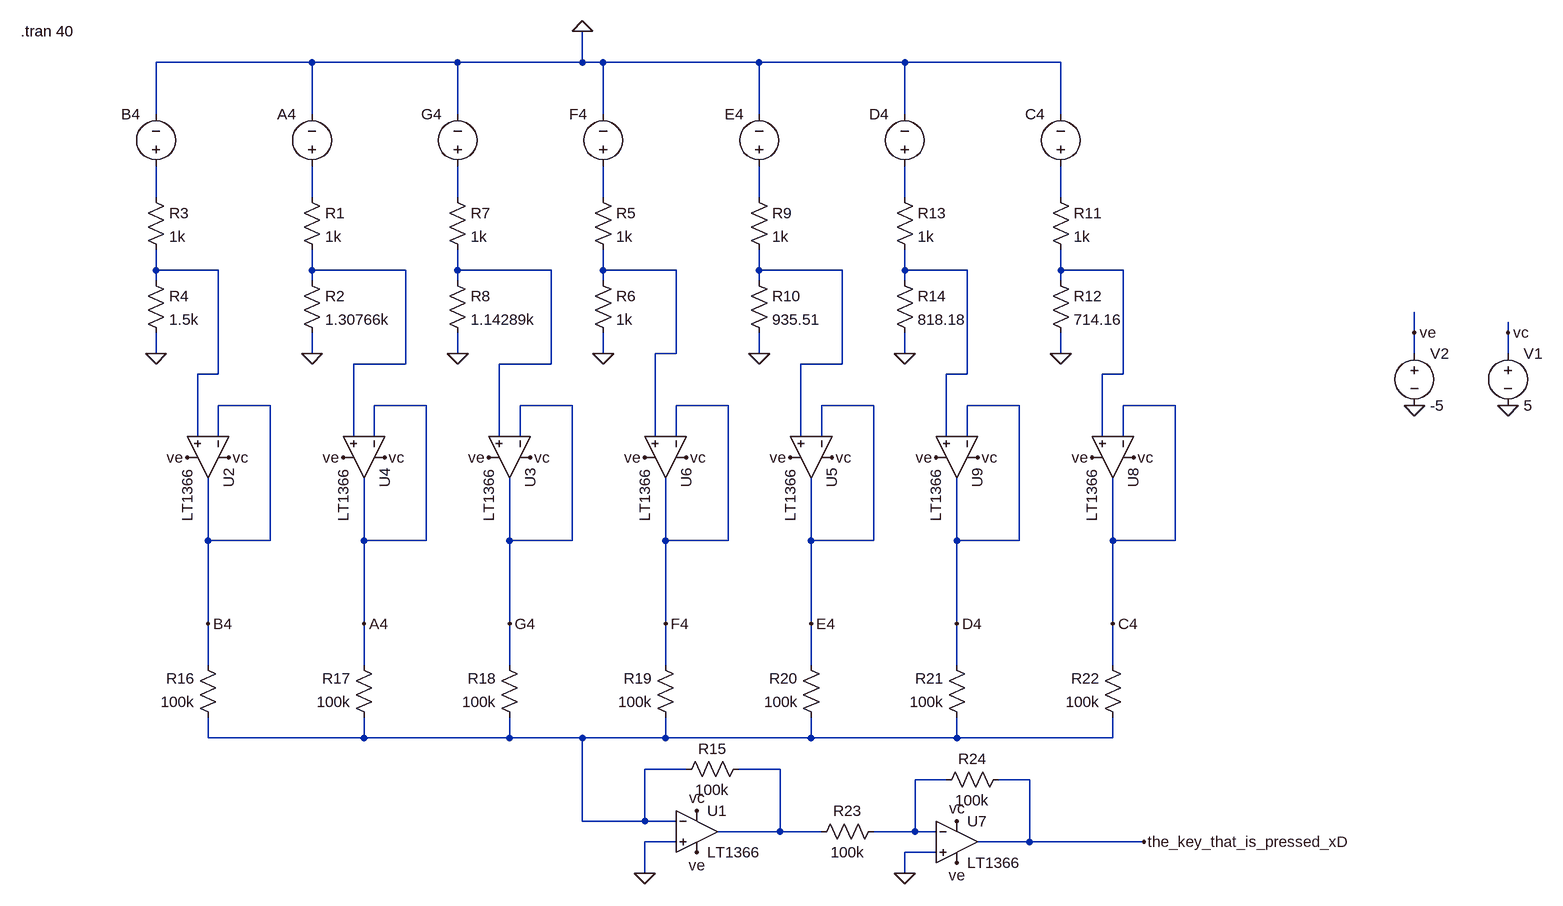
[diagram p0: schematic keyboard_controls_unfinished.asc]
keyboard_controls_unfinished.asc, the LTspice schematic file:
Version 4
SHEET 1 1096 1716
WIRE -800 48 -1040 48
WIRE -576 48 -800 48
WIRE -384 48 -384 0
WIRE -384 48 -576 48
WIRE -352 48 -384 48
WIRE -112 48 -352 48
WIRE 112 48 -112 48
WIRE 352 48 112 48
WIRE -1040 128 -1040 48
WIRE -800 128 -800 48
WIRE -576 128 -576 48
WIRE -352 128 -352 48
WIRE -112 128 -112 48
WIRE 112 128 112 48
WIRE 352 128 352 48
WIRE -1040 256 -1040 208
WIRE -800 256 -800 208
WIRE -576 256 -576 208
WIRE -352 256 -352 208
WIRE -112 256 -112 208
WIRE 112 256 112 208
WIRE 352 256 352 208
WIRE -1040 368 -1040 336
WIRE -944 368 -1040 368
WIRE -800 368 -800 336
WIRE -656 368 -800 368
WIRE -576 368 -576 336
WIRE -432 368 -576 368
WIRE -352 368 -352 336
WIRE -240 368 -352 368
WIRE -112 368 -112 336
WIRE 16 368 -112 368
WIRE 112 368 112 336
WIRE 208 368 112 368
WIRE 352 368 352 336
WIRE 448 368 352 368
WIRE -1040 384 -1040 368
WIRE -800 384 -800 368
WIRE -576 384 -576 368
WIRE -352 384 -352 368
WIRE -112 384 -112 368
WIRE 112 384 112 368
WIRE 352 384 352 368
WIRE 896 464 896 432
WIRE 1040 464 1040 448
WIRE -1040 496 -1040 464
WIRE -800 496 -800 464
WIRE -576 496 -576 464
WIRE -352 496 -352 464
WIRE -240 496 -240 368
WIRE -240 496 -272 496
WIRE -112 496 -112 464
WIRE 112 496 112 464
WIRE 352 496 352 464
WIRE 896 496 896 464
WIRE 1040 496 1040 464
WIRE -656 512 -656 368
WIRE -656 512 -736 512
WIRE -432 512 -432 368
WIRE -432 512 -512 512
WIRE 16 512 16 368
WIRE 16 512 -48 512
WIRE -944 528 -944 368
WIRE -944 528 -976 528
WIRE 208 528 208 368
WIRE 208 528 176 528
WIRE 448 528 448 368
WIRE 448 528 416 528
WIRE -864 576 -944 576
WIRE -624 576 -704 576
WIRE -400 576 -480 576
WIRE -160 576 -240 576
WIRE 64 576 -16 576
WIRE 288 576 208 576
WIRE 528 576 448 576
WIRE -976 624 -976 528
WIRE -944 624 -944 576
WIRE -736 624 -736 512
WIRE -704 624 -704 576
WIRE -512 624 -512 512
WIRE -480 624 -480 576
WIRE -272 624 -272 496
WIRE -240 624 -240 576
WIRE -48 624 -48 512
WIRE -16 624 -16 576
WIRE 176 624 176 528
WIRE 208 624 208 576
WIRE 416 624 416 528
WIRE 448 624 448 576
WIRE -960 784 -960 688
WIRE -864 784 -864 576
WIRE -864 784 -960 784
WIRE -720 784 -720 688
WIRE -624 784 -624 576
WIRE -624 784 -720 784
WIRE -496 784 -496 688
WIRE -400 784 -400 576
WIRE -400 784 -496 784
WIRE -256 784 -256 688
WIRE -160 784 -160 576
WIRE -160 784 -256 784
WIRE -32 784 -32 688
WIRE 64 784 64 576
WIRE 64 784 -32 784
WIRE 192 784 192 688
WIRE 288 784 288 576
WIRE 288 784 192 784
WIRE 432 784 432 688
WIRE 528 784 528 576
WIRE 528 784 432 784
WIRE -960 912 -960 784
WIRE -720 912 -720 784
WIRE -496 912 -496 784
WIRE -256 912 -256 784
WIRE -32 912 -32 784
WIRE 192 912 192 784
WIRE 432 912 432 784
WIRE -960 976 -960 912
WIRE -720 976 -720 912
WIRE -496 976 -496 912
WIRE -256 976 -256 912
WIRE -32 976 -32 912
WIRE 192 976 192 912
WIRE 432 976 432 912
WIRE -960 1088 -960 1056
WIRE -720 1088 -720 1056
WIRE -720 1088 -960 1088
WIRE -496 1088 -496 1056
WIRE -496 1088 -720 1088
WIRE -384 1088 -496 1088
WIRE -256 1088 -256 1056
WIRE -256 1088 -384 1088
WIRE -32 1088 -32 1056
WIRE -32 1088 -256 1088
WIRE 192 1088 192 1056
WIRE 192 1088 -32 1088
WIRE 432 1088 432 1056
WIRE 432 1088 192 1088
WIRE -224 1136 -288 1136
WIRE -80 1136 -144 1136
WIRE 176 1152 128 1152
WIRE 304 1152 256 1152
WIRE -384 1216 -384 1088
WIRE -288 1216 -288 1136
WIRE -288 1216 -384 1216
WIRE -240 1216 -288 1216
WIRE -80 1232 -80 1136
WIRE -80 1232 -176 1232
WIRE -16 1232 -80 1232
WIRE 128 1232 128 1152
WIRE 128 1232 64 1232
WIRE 160 1232 128 1232
WIRE -240 1248 -288 1248
WIRE 304 1248 304 1152
WIRE 304 1248 224 1248
WIRE 480 1248 304 1248
WIRE 160 1264 112 1264
WIRE -288 1296 -288 1248
WIRE 112 1296 112 1264
FLAG -800 496 0
FLAG -1040 496 0
FLAG -352 496 0
FLAG -576 496 0
FLAG -112 496 0
FLAG 352 496 0
FLAG 112 496 0
FLAG -384 0 0
FLAG 432 912 C4
FLAG 192 912 D4
FLAG -32 912 E4
FLAG -256 912 F4
FLAG -496 912 G4
FLAG -720 912 A4
FLAG -960 912 B4
FLAG -288 1296 0
FLAG 1040 576 0
FLAG 1040 464 vc
FLAG 896 576 0
FLAG 896 464 ve
FLAG 464 656 vc
FLAG 224 656 vc
FLAG 0 656 vc
FLAG -224 656 vc
FLAG -464 656 vc
FLAG -688 656 vc
FLAG -928 656 vc
FLAG -208 1200 vc
FLAG 400 656 ve
FLAG 160 656 ve
FLAG -64 656 ve
FLAG -288 656 ve
FLAG -528 656 ve
FLAG -752 656 ve
FLAG -992 656 ve
FLAG -208 1264 ve
FLAG 112 1296 0
FLAG 192 1216 vc
FLAG 192 1280 ve
FLAG 480 1248 the_key_that_is_pressed_xD
SYMBOL res -816 240 R0
SYMATTR InstName R1
SYMATTR Value 1k
SYMBOL res -816 368 R0
SYMATTR InstName R2
SYMATTR Value 1.30766k
SYMBOL res -1056 240 R0
SYMATTR InstName R3
SYMATTR Value 1k
SYMBOL res -1056 368 R0
SYMATTR InstName R4
SYMATTR Value 1.5k
SYMBOL res -368 240 R0
SYMATTR InstName R5
SYMATTR Value 1k
SYMBOL res -368 368 R0
SYMATTR InstName R6
SYMATTR Value 1k
SYMBOL res -592 240 R0
SYMATTR InstName R7
SYMATTR Value 1k
SYMBOL res -592 368 R0
SYMATTR InstName R8
SYMATTR Value 1.14289k
SYMBOL res -128 240 R0
SYMATTR InstName R9
SYMATTR Value 1k
SYMBOL res -128 368 R0
SYMATTR InstName R10
SYMATTR Value 935.51
SYMBOL res 336 240 R0
SYMATTR InstName R11
SYMATTR Value 1k
SYMBOL res 336 368 R0
SYMATTR InstName R12
SYMATTR Value 714.16
SYMBOL res 96 240 R0
SYMATTR InstName R13
SYMATTR Value 1k
SYMBOL res 96 368 R0
SYMATTR InstName R14
SYMATTR Value 818.18
SYMBOL voltage -1040 224 R180
WINDOW 0 24 96 Left 2
WINDOW 3 24 16 Invisible 2
WINDOW 123 0 0 Left 0
WINDOW 39 0 0 Left 0
SYMATTR InstName B4
SYMATTR Value PWL(30.499999 0 30.5 5 35 5 35.00000000001 0)
SYMBOL voltage -800 224 R180
WINDOW 0 24 96 Left 2
WINDOW 3 24 16 Invisible 2
WINDOW 123 0 0 Left 0
WINDOW 39 0 0 Left 0
SYMATTR InstName A4
SYMATTR Value PWL(25.49999999 0 25.5 5 30 5 30.00000000000001 0)
SYMBOL voltage -576 224 R180
WINDOW 0 24 96 Left 2
WINDOW 3 24 68 Invisible 2
WINDOW 123 0 0 Left 0
WINDOW 39 0 0 Left 0
SYMATTR InstName G4
SYMATTR Value PWL(20.4999999 0 20.5 5 25 5 25.0000000001 0)
SYMBOL voltage -352 224 R180
WINDOW 0 24 96 Left 2
WINDOW 3 24 68 Invisible 2
WINDOW 123 0 0 Left 0
WINDOW 39 0 0 Left 0
SYMATTR InstName F4
SYMATTR Value PWL(15.499999 0 15.5 5 20 5 20.00000001 0)
SYMBOL voltage -112 224 R180
WINDOW 0 24 96 Left 2
WINDOW 3 24 68 Invisible 2
WINDOW 123 0 0 Left 0
WINDOW 39 0 0 Left 0
SYMATTR InstName E4
SYMATTR Value PWL(10.499999 0 10.5 5 15 5 15.00000001 0)
SYMBOL voltage 112 224 R180
WINDOW 0 24 96 Left 2
WINDOW 3 24 68 Invisible 2
WINDOW 123 0 0 Left 0
WINDOW 39 0 0 Left 0
SYMATTR InstName D4
SYMATTR Value PWL(5.49999 0 5.5 5 10 5 10.000001 0)
SYMBOL voltage 352 224 R180
WINDOW 0 24 96 Left 2
WINDOW 3 24 68 Invisible 2
WINDOW 123 0 0 Left 0
WINDOW 39 0 0 Left 0
SYMATTR InstName C4
SYMATTR Value PWL(0 5 5 5 5.00000001 0)
SYMBOL Opamps\\LT1366 -208 1168 R0
SYMATTR InstName U1
SYMBOL res -128 1120 R90
WINDOW 0 0 56 VBottom 2
WINDOW 3 32 56 VTop 2
SYMATTR InstName R15
SYMATTR Value 100k
SYMBOL res -944 1072 R180
WINDOW 0 36 76 Left 2
WINDOW 3 36 40 Left 2
SYMATTR InstName R16
SYMATTR Value 100k
SYMBOL res -704 1072 R180
WINDOW 0 36 76 Left 2
WINDOW 3 36 40 Left 2
SYMATTR InstName R17
SYMATTR Value 100k
SYMBOL res -480 1072 R180
WINDOW 0 36 76 Left 2
WINDOW 3 36 40 Left 2
SYMATTR InstName R18
SYMATTR Value 100k
SYMBOL res -240 1072 R180
WINDOW 0 36 76 Left 2
WINDOW 3 36 40 Left 2
SYMATTR InstName R19
SYMATTR Value 100k
SYMBOL res -16 1072 R180
WINDOW 0 36 76 Left 2
WINDOW 3 36 40 Left 2
SYMATTR InstName R20
SYMATTR Value 100k
SYMBOL res 208 1072 R180
WINDOW 0 36 76 Left 2
WINDOW 3 36 40 Left 2
SYMATTR InstName R21
SYMATTR Value 100k
SYMBOL res 448 1072 R180
WINDOW 0 36 76 Left 2
WINDOW 3 36 40 Left 2
SYMATTR InstName R22
SYMATTR Value 100k
SYMBOL Opamps\\LT1366 -432 656 R90
SYMATTR InstName U3
SYMBOL Opamps\\LT1366 -896 656 R90
SYMATTR InstName U2
SYMBOL Opamps\\LT1366 -656 656 R90
SYMATTR InstName U4
SYMBOL Opamps\\LT1366 32 656 R90
SYMATTR InstName U5
SYMBOL Opamps\\LT1366 -192 656 R90
SYMATTR InstName U6
SYMBOL Opamps\\LT1366 496 656 R90
SYMATTR InstName U8
SYMBOL Opamps\\LT1366 256 656 R90
SYMATTR InstName U9
SYMBOL voltage 1040 480 R0
SYMATTR InstName V1
SYMATTR Value 5
SYMBOL voltage 896 480 R0
SYMATTR InstName V2
SYMATTR Value -5
SYMBOL Opamps\\LT1366 192 1184 R0
SYMATTR InstName U7
SYMBOL res 80 1216 R90
WINDOW 0 0 56 VBottom 2
WINDOW 3 32 56 VTop 2
SYMATTR InstName R23
SYMATTR Value 100k
SYMBOL res 272 1136 R90
WINDOW 0 0 56 VBottom 2
WINDOW 3 32 56 VTop 2
SYMATTR InstName R24
SYMATTR Value 100k
TEXT -1248 0 Left 2 !.tran 40

The netlist it stands for:
* keyboard_controls_unfinished.asc
R1 N002 N009 1k
R2 N009 0 1.30766k
R3 N001 N008 1k
R4 N008 0 1.5k
R5 N004 N011 1k
R6 N011 0 1k
R7 N003 N010 1k
R8 N010 0 1.14289k
R9 N005 N012 1k
R10 N012 0 935.51
R11 N007 N014 1k
R12 N014 0 714.16
R13 N006 N013 1k
R14 N013 0 818.18
V§B4 N001 0 PWL(30.499999 0 30.5 5 35 5 35.00000000001 0)
V§A4 N002 0 PWL(25.49999999 0 25.5 5 30 5 30.00000000000001 0)
V§G4 N003 0 PWL(20.4999999 0 20.5 5 25 5 25.0000000001 0)
V§F4 N004 0 PWL(15.499999 0 15.5 5 20 5 20.00000001 0)
V§E4 N005 0 PWL(10.499999 0 10.5 5 15 5 15.00000001 0)
V§D4 N006 0 PWL(5.49999 0 5.5 5 10 5 10.000001 0)
V§C4 N007 0 PWL(0 5 5 5 5.00000001 0)
XU1 0 N015 vc ve N016 LT1366  ; pins In+ In- V+ V- OUT
R15 N016 N015 100k
R16 N015 B4 100k
R17 N015 A4 100k
R18 N015 G4 100k
R19 N015 F4 100k
R20 N015 E4 100k
R21 N015 D4 100k
R22 N015 C4 100k
XU3 N010 G4 vc ve G4 LT1366  ; pins In+ In- V+ V- OUT
XU2 N008 B4 vc ve B4 LT1366  ; pins In+ In- V+ V- OUT
XU4 N009 A4 vc ve A4 LT1366  ; pins In+ In- V+ V- OUT
XU5 N012 E4 vc ve E4 LT1366  ; pins In+ In- V+ V- OUT
XU6 N011 F4 vc ve F4 LT1366  ; pins In+ In- V+ V- OUT
XU8 N014 C4 vc ve C4 LT1366  ; pins In+ In- V+ V- OUT
XU9 N013 D4 vc ve D4 LT1366  ; pins In+ In- V+ V- OUT
V1 vc 0 5
V2 ve 0 -5
XU7 0 N017 vc ve the_key_that_is_pressed_xD LT1366  ; pins In+ In- V+ V- OUT
R23 N017 N016 100k
R24 the_key_that_is_pressed_xD N017 100k
.tran 40
.lib LTC.lib
.backanno
.end